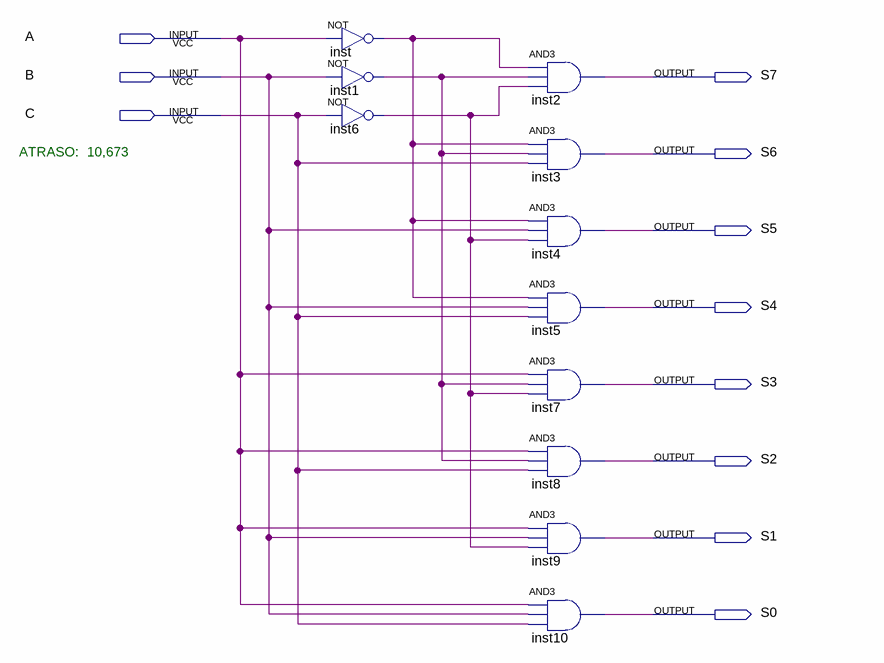
[diagram p0: schematic sheet]
// Quartus schematic decoder3_8.bdf as structural Verilog: 11 symbols, 11 pins
module decoder3_8 (
  input  A,
  input  B,
  input  C,
  output S7,
  output S6,
  output S5,
  output S4,
  output S3,
  output S2,
  output S1,
  output S0
);

  wire inst1_out, inst6_out, inst_out;

  not inst (inst_out, A);
  not inst1 (inst1_out, B);
  not inst6 (inst6_out, C);
  and inst2 (S7, inst_out, inst1_out, inst6_out);
  and inst3 (S6, inst_out, inst1_out, C);
  and inst4 (S5, inst_out, B, inst6_out);
  and inst5 (S4, inst_out, B, C);
  and inst7 (S3, A, inst1_out, inst6_out);
  and inst8 (S2, A, inst1_out, C);
  and inst9 (S1, A, B, inst6_out);
  and inst10 (S0, A, B, C);

  // Notes on the sheet:
  //   ATRASO:  10,673
endmodule
